# Altium schematic sheet FPGA_IO.SchDoc
size B; SheetNumber: 2; SheetTotal: 2
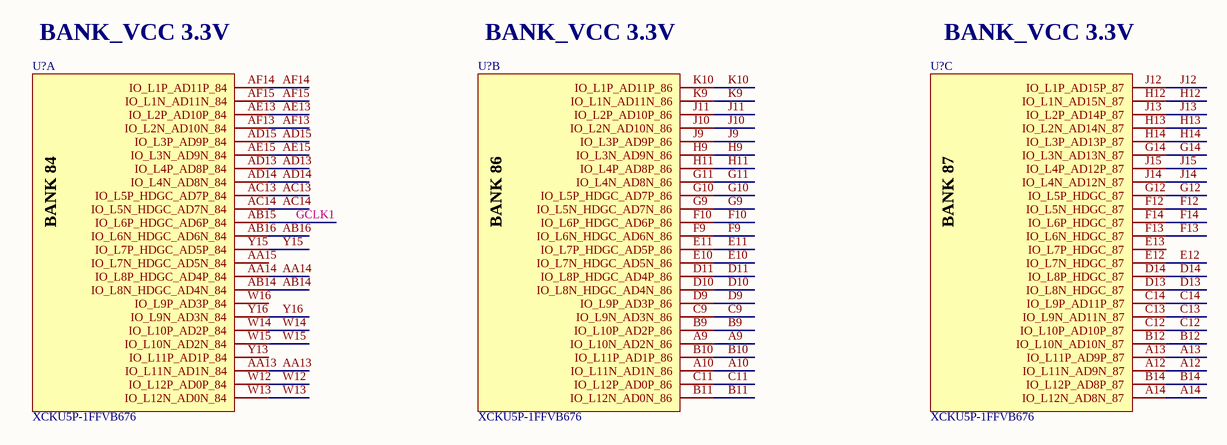
[diagram p0: FPGA_IO.SchDoc]

## Parts
(Parts that share a designator on the sheet are numbered #1, #2 ... from top to bottom, then left to right.)
U?#1  XCKU5P-1FFVB676  (part A of 11)
U?#2  XCKU5P-1FFVB676  (part B of 11)
U?#3  XCKU5P-1FFVB676  (part C of 11)

## Nets
A9: U?#2.A9(IO_L10N_AD2N_86)
A10: U?#2.A10(IO_L11N_AD1N_86)
A12: U?#3.A12(IO_L11N_AD9N_87)
A13: U?#3.A13(IO_L11P_AD9P_87)
A14: U?#3.A14(IO_L12N_AD8N_87)
AA13: U?#1.AA13(IO_L11N_AD1N_84)
AA14: U?#1.AA14(IO_L8P_HDGC_AD4P_84)
AB14: U?#1.AB14(IO_L8N_HDGC_AD4N_84)
AB16: U?#1.AB16(IO_L6N_HDGC_AD6N_84)
AC13: U?#1.AC13(IO_L5P_HDGC_AD7P_84)
AC14: U?#1.AC14(IO_L5N_HDGC_AD7N_84)
AD13: U?#1.AD13(IO_L4P_AD8P_84)
AD14: U?#1.AD14(IO_L4N_AD8N_84)
AD15: U?#1.AD15(IO_L3P_AD9P_84)
AE13: U?#1.AE13(IO_L2P_AD10P_84)
AE15: U?#1.AE15(IO_L3N_AD9N_84)
AF13: U?#1.AF13(IO_L2N_AD10N_84)
AF14: U?#1.AF14(IO_L1P_AD11P_84)
AF15: U?#1.AF15(IO_L1N_AD11N_84)
B9: U?#2.B9(IO_L10P_AD2P_86)
B10: U?#2.B10(IO_L11P_AD1P_86)
B11: U?#2.B11(IO_L12N_AD0N_86)
B12: U?#3.B12(IO_L10N_AD10N_87)
B14: U?#3.B14(IO_L12P_AD8P_87)
C9: U?#2.C9(IO_L9N_AD3N_86)
C11: U?#2.C11(IO_L12P_AD0P_86)
C12: U?#3.C12(IO_L10P_AD10P_87)
C13: U?#3.C13(IO_L9N_AD11N_87)
C14: U?#3.C14(IO_L9P_AD11P_87)
D9: U?#2.D9(IO_L9P_AD3P_86)
D10: U?#2.D10(IO_L8N_HDGC_AD4N_86)
D11: U?#2.D11(IO_L8P_HDGC_AD4P_86)
D13: U?#3.D13(IO_L8N_HDGC_87)
D14: U?#3.D14(IO_L8P_HDGC_87)
E10: U?#2.E10(IO_L7N_HDGC_AD5N_86)
E11: U?#2.E11(IO_L7P_HDGC_AD5P_86)
E12: U?#3.E12(IO_L7N_HDGC_87)
F9: U?#2.F9(IO_L6N_HDGC_AD6N_86)
F10: U?#2.F10(IO_L6P_HDGC_AD6P_86)
F12: U?#3.F12(IO_L5N_HDGC_87)
F13: U?#3.F13(IO_L6N_HDGC_87)
F14: U?#3.F14(IO_L6P_HDGC_87)
G9: U?#2.G9(IO_L5N_HDGC_AD7N_86)
G10: U?#2.G10(IO_L5P_HDGC_AD7P_86)
G11: U?#2.G11(IO_L4N_AD8N_86)
G12: U?#3.G12(IO_L5P_HDGC_87)
G14: U?#3.G14(IO_L3N_AD13N_87)
GCLK1: U?#1.AB15(IO_L6P_HDGC_AD6P_84)
H9: U?#2.H9(IO_L3N_AD9N_86)
H11: U?#2.H11(IO_L4P_AD8P_86)
H12: U?#3.H12(IO_L1N_AD15N_87)
H13: U?#3.H13(IO_L2N_AD14N_87)
H14: U?#3.H14(IO_L3P_AD13P_87)
J9: U?#2.J9(IO_L3P_AD9P_86)
J10: U?#2.J10(IO_L2N_AD10N_86)
J11: U?#2.J11(IO_L2P_AD10P_86)
J12: U?#3.J12(IO_L1P_AD15P_87)
J13: U?#3.J13(IO_L2P_AD14P_87)
J14: U?#3.J14(IO_L4N_AD12N_87)
J15: U?#3.J15(IO_L4P_AD12P_87)
K9: U?#2.K9(IO_L1N_AD11N_86)
K10: U?#2.K10(IO_L1P_AD11P_86)
W12: U?#1.W12(IO_L12P_AD0P_84)
W13: U?#1.W13(IO_L12N_AD0N_84)
W14: U?#1.W14(IO_L10P_AD2P_84)
W15: U?#1.W15(IO_L10N_AD2N_84)
Y15: U?#1.Y15(IO_L7P_HDGC_AD5P_84)
Y16: U?#1.Y16(IO_L9N_AD3N_84)

Not connected (* = marked no-connect by the designer): U?#1 AA15(IO_L7N_HDGC_AD5N_84) W16(IO_L9P_AD3P_84) Y13(IO_L11P_AD1P_84); U?#3 E13(IO_L7P_HDGC_87)

## Notes on the sheet
- BANK_VCC 3.3V
- (near U?#3) BANK_VCC 3.3V
- (in symbol XCKU5P-FFVB676, part A) BANK 84
- (in symbol XCKU5P-FFVB676, part B) BANK 86
- (in symbol XCKU5P-FFVB676, part C) BANK 87

## Library data of the parts
U?#1-U?#3 = XCKU5P-FFVB676